# Altium schematic sheet M2RB.SchDoc
size B
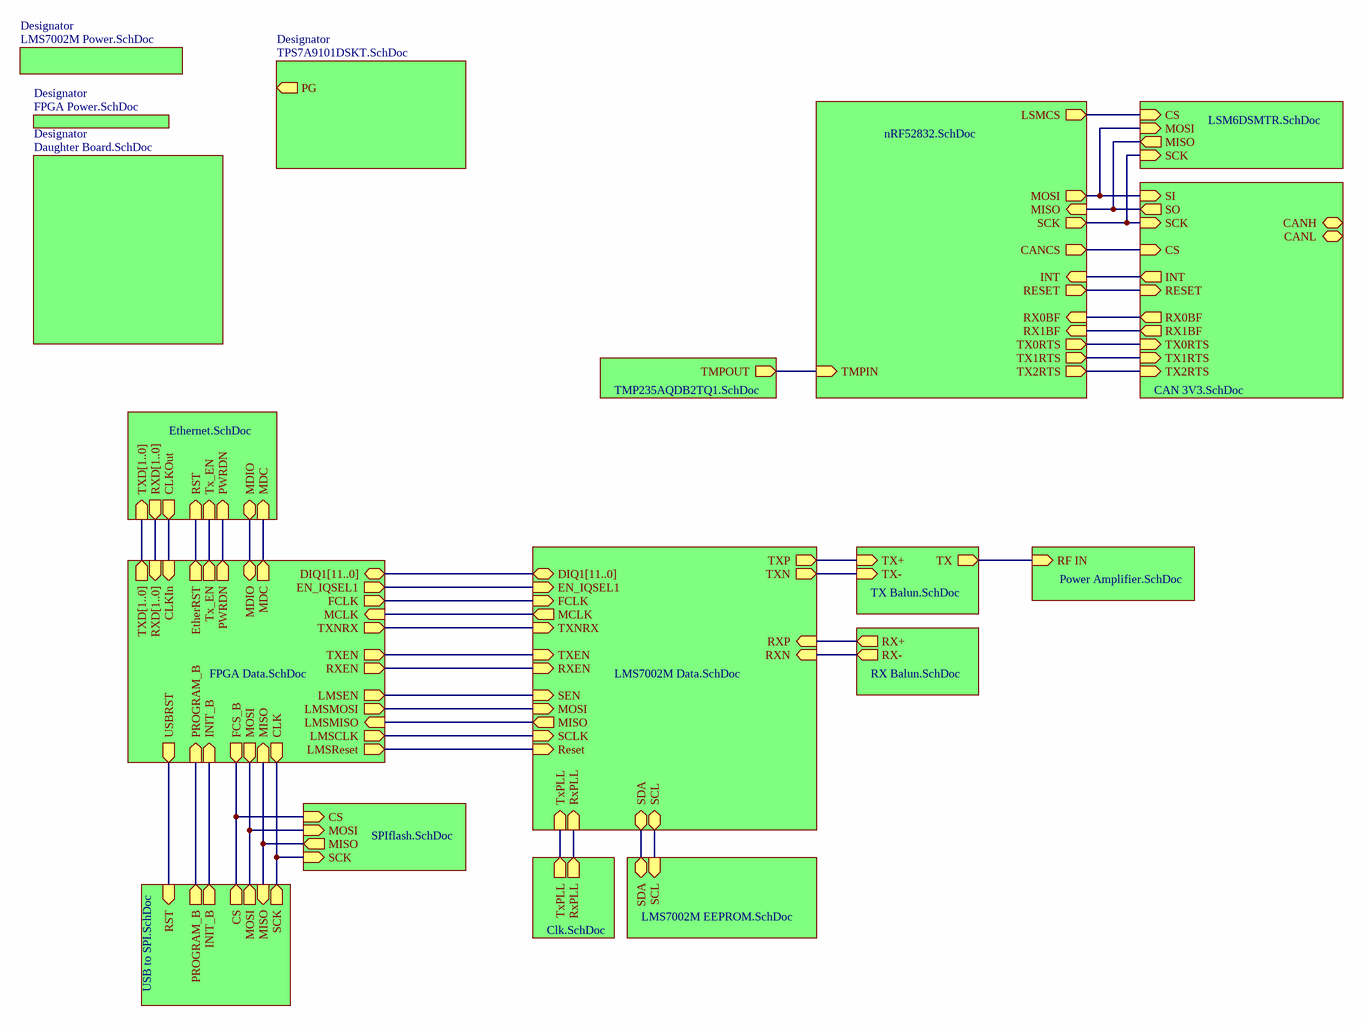
[diagram p0: M2RB.SchDoc]

## Sub-sheets
Designator = Power Amplifier.SchDoc: RF IN (in)
Designator = Daughter Board.SchDoc: no entries
Designator = nRF52832.SchDoc: MOSI (out), MISO (in), TX0RTS (out), TX1RTS (out), RX1BF (in), SCK (out), RESET (out), RX0BF (in), TX2RTS (out), INT (in), CANCS (out), LSMCS (out), TMPIN (in)
Designator = LMS7002M Power.SchDoc: no entries
Designator = FPGA Power.SchDoc: no entries
Designator = LMS7002M Data.SchDoc: DIQ1[11..0] (bidir), MOSI (in), MCLK (out), SCL (bidir), TxPLL (in), TXN (out), SEN (in), SDA (bidir), RxPLL (in), EN_IQSEL1 (in), TXNRX (in), FCLK (in), TXEN (in), SCLK (in), RXN (in), MISO (out), Reset (in), RXP (in), RXEN (in), TXP (out)
Designator = LMS7002M EEPROM.SchDoc: SCL (in), SDA (bidir)
Designator = FPGA Data.SchDoc: CLK (out), PROGRAM_B (in), MOSI (out), FCS_B (out), INIT_B (in), MISO (in), DIQ1[11..0] (bidir), TXEN (out), RXEN (out), EN_IQSEL1 (out), TXNRX (out), FCLK (out), MCLK (in), LMSMOSI (out), LMSEN (out), LMSCLK (out), LMSMISO (in), LMSReset (out), TXD[1..0] (out), RXD[1..0] (in), CLKIn (in), EtherRST (out), Tx_EN (out), MDC (out), PWRDN (out), MDIO (bidir), USBRST (out)
Designator = Clk.SchDoc: TxPLL (out), RxPLL (out)
Designator = RX Balun.SchDoc: RX+ (out), RX- (out)
Designator = TX Balun.SchDoc: TX- (in), TX (out), TX+ (in)
Designator = Ethernet.SchDoc: TXD[1..0] (in), RXD[1..0] (out), CLKOut (out), RST (in), Tx_EN (in), MDC (in), PWRDN (in), MDIO (bidir)
Designator = TPS7A9101DSKT.SchDoc: PG (out)
Designator = SPIflash.SchDoc: CS (in), MOSI (in), MISO (out), SCK (in)
Designator = USB to SPI.SchDoc: MISO (in), SCK (out), RST (in), PROGRAM_B (out), CS (out), MOSI (out), INIT_B (out)
Designator = CAN 3V3.SchDoc: SI (in), RX0BF (out), INT (out), RX1BF (out), TX2RTS (in), TX1RTS (in), TX0RTS (in), SO (out), RESET (in), CS (in), SCK (in), CANL (bidir), CANH (bidir)
Designator = LSM6DSMTR.SchDoc: MISO (out), CS (in), SCK (in), MOSI (in)
Designator = TMP235AQDB2TQ1.SchDoc: TMPOUT (out)

## Nets
(unnamed): sheet Designator/RF IN, sheet Designator/TX
(unnamed): sheet Designator/MOSI, sheet Designator/SI, sheet Designator/MOSI
(unnamed): sheet Designator/MISO, sheet Designator/SO, sheet Designator/MISO
(unnamed): sheet Designator/TX0RTS, sheet Designator/TX0RTS
(unnamed): sheet Designator/TX1RTS, sheet Designator/TX1RTS
(unnamed): sheet Designator/RX1BF, sheet Designator/RX1BF
(unnamed): sheet Designator/SCK, sheet Designator/SCK, sheet Designator/SCK
(unnamed): sheet Designator/RESET, sheet Designator/RESET
(unnamed): sheet Designator/RX0BF, sheet Designator/RX0BF
(unnamed): sheet Designator/TX2RTS, sheet Designator/TX2RTS
(unnamed): sheet Designator/INT, sheet Designator/INT
(unnamed): sheet Designator/CANCS, sheet Designator/CS
(unnamed): sheet Designator/LSMCS, sheet Designator/CS
(unnamed): sheet Designator/TMPIN, sheet Designator/TMPOUT
(unnamed): sheet Designator/MOSI, sheet Designator/LMSMOSI
(unnamed): sheet Designator/MCLK, sheet Designator/MCLK
(unnamed): sheet Designator/SCL, sheet Designator/SCL
(unnamed): sheet Designator/TxPLL, sheet Designator/TxPLL
(unnamed): sheet Designator/TXN, sheet Designator/TX-
(unnamed): sheet Designator/SEN, sheet Designator/LMSEN
(unnamed): sheet Designator/SDA, sheet Designator/SDA
(unnamed): sheet Designator/RxPLL, sheet Designator/RxPLL
(unnamed): sheet Designator/EN_IQSEL1, sheet Designator/EN_IQSEL1
(unnamed): sheet Designator/TXNRX, sheet Designator/TXNRX
(unnamed): sheet Designator/FCLK, sheet Designator/FCLK
(unnamed): sheet Designator/TXEN, sheet Designator/TXEN
(unnamed): sheet Designator/SCLK, sheet Designator/LMSCLK
(unnamed): sheet Designator/RXN, sheet Designator/RX-
(unnamed): sheet Designator/MISO, sheet Designator/LMSMISO
(unnamed): sheet Designator/Reset, sheet Designator/LMSReset
(unnamed): sheet Designator/RXP, sheet Designator/RX+
(unnamed): sheet Designator/RXEN, sheet Designator/RXEN
(unnamed): sheet Designator/TXP, sheet Designator/TX+
(unnamed): sheet Designator/CLK, sheet Designator/SCK, sheet Designator/SCK
(unnamed): sheet Designator/PROGRAM_B, sheet Designator/PROGRAM_B
(unnamed): sheet Designator/MOSI, sheet Designator/MOSI, sheet Designator/MOSI
(unnamed): sheet Designator/FCS_B, sheet Designator/CS, sheet Designator/CS
(unnamed): sheet Designator/INIT_B, sheet Designator/INIT_B
(unnamed): sheet Designator/MISO, sheet Designator/MISO, sheet Designator/MISO
(unnamed): sheet Designator/CLKIn, sheet Designator/CLKOut
(unnamed): sheet Designator/EtherRST, sheet Designator/RST
(unnamed): sheet Designator/Tx_EN, sheet Designator/Tx_EN
(unnamed): sheet Designator/MDC, sheet Designator/MDC
(unnamed): sheet Designator/PWRDN, sheet Designator/PWRDN
(unnamed): sheet Designator/MDIO, sheet Designator/MDIO
(unnamed): sheet Designator/USBRST, sheet Designator/RST